# Altium schematic sheet SDNL.SchDoc
size A; SheetNumber: 1; SheetTotal: 1
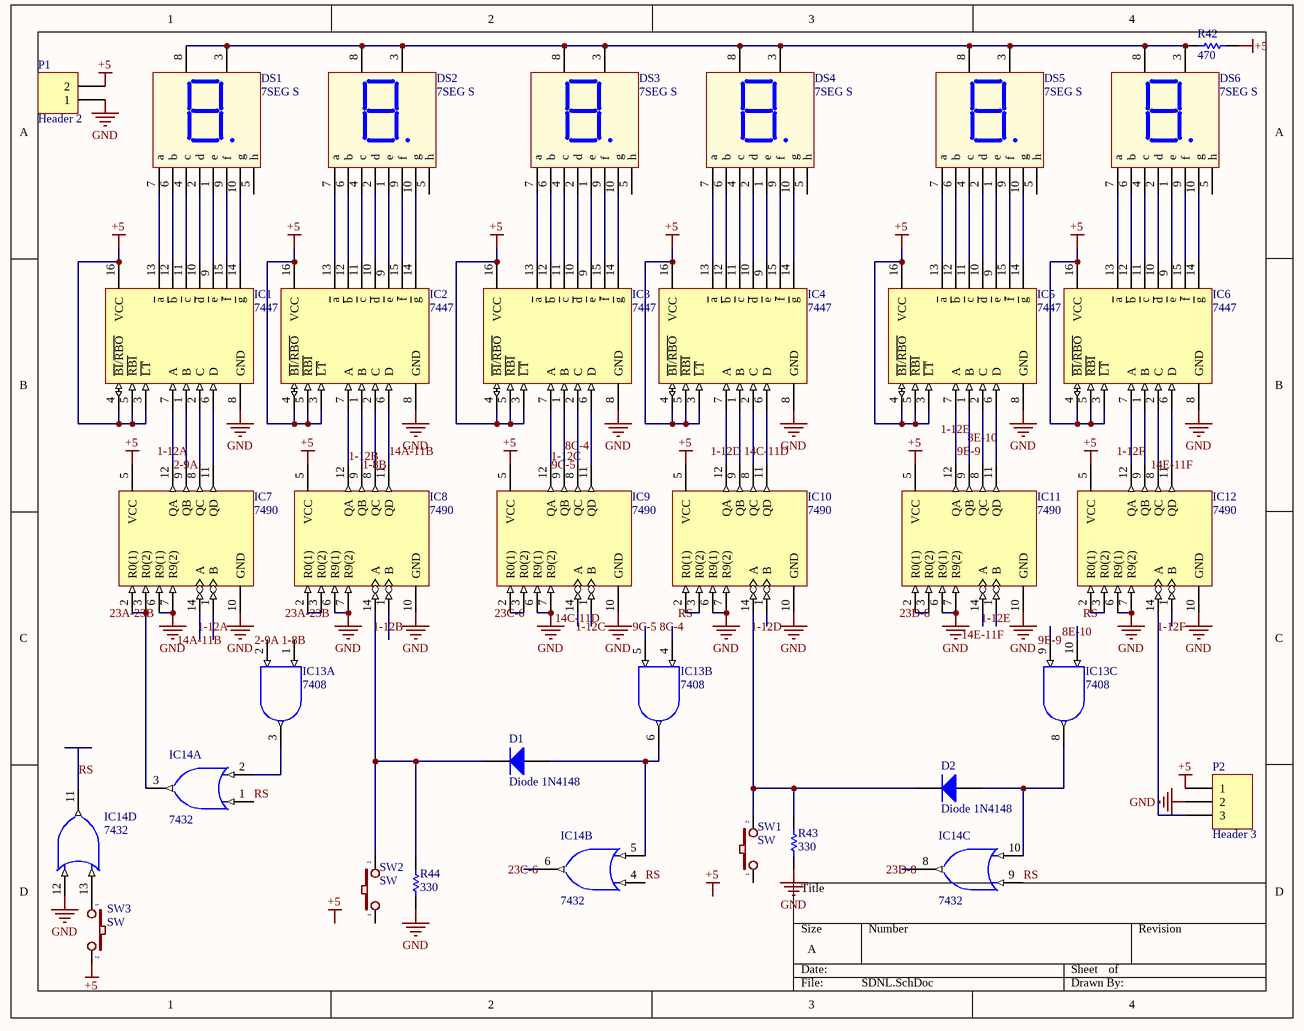
[diagram p0: SDNL.SchDoc]

## Parts
D1  Diode 1N4148  [DO-35]
D2  Diode 1N4148  [DO-35]
DS1  7SEG S  [7SEGS]
DS2  7SEG S  [7SEGS]
DS3  7SEG S  [7SEGS]
DS4  7SEG S  [7SEGS]
DS5  7SEG S  [7SEGS]
DS6  7SEG S  [7SEGS]
IC1  7447  [DIP16/W0.3]
IC2  7447  [DIP16/W0.3]
IC3  7447  [DIP16/W0.3]
IC4  7447  [DIP16/W0.3]
IC5  7447  [DIP16/W0.3]
IC6  7447  [DIP16/W0.3]
IC7  7490  [DIP14/W0.3]
IC8  7490  [DIP14/W0.3]
IC9  7490  [DIP14/W0.3]
IC10  7490  [DIP14/W0.3]
IC11  7490  [DIP14/W0.3]
IC12  7490  [DIP14/W0.3]
IC13  7408  [DIP14/W0.3]  (parts A,B,C of 4)
IC14  7432  [DIP14/W0.3]  (parts A,B,C,D of 4)
P1  Header 2  [TBlock 2]
P2  Header 3  [Header 3]
R42  value 470  [Res 10mm (1/2W)]  (hidden comment: RESISTOR)
R43  value 330  [Res 10mm (1/2W)]  (hidden comment: RESISTOR)
R44  value 330  [Res 10mm (1/2W)]  (hidden comment: RESISTOR)
SW1  SW  [SW2]
SW2  SW  [SW2]
SW3  SW  [SW2]

## Nets
+5: IC1.3(~{LT}) IC1.4(~{BI}/~{RBO}) IC1.5(~{RBI}) IC1.16(VCC) IC2.3(~{LT}) IC2.4(~{BI}/~{RBO}) IC2.5(~{RBI}) IC2.16(VCC) IC3.3(~{LT}) IC3.4(~{BI}/~{RBO}) IC3.5(~{RBI}) IC3.16(VCC) IC4.3(~{LT}) IC4.4(~{BI}/~{RBO}) IC4.5(~{RBI}) IC4.16(VCC) IC5.3(~{LT}) IC5.4(~{BI}/~{RBO}) IC5.5(~{RBI}) IC5.16(VCC) IC6.3(~{LT}) IC6.4(~{BI}/~{RBO}) IC6.5(~{RBI}) IC6.16(VCC) IC7.5(VCC) IC8.5(VCC) IC9.5(VCC) IC10.5(VCC) IC11.5(VCC) IC12.5(VCC) P1.2 P2.1 R42.1 SW3.2
GND: IC1.8(GND) IC2.8(GND) IC3.8(GND) IC4.8(GND) IC5.8(GND) IC6.8(GND) IC7.6(R9(1)) IC7.7(R9(2)) IC7.10(GND) IC8.6(R9(1)) IC8.7(R9(2)) IC8.10(GND) IC9.6(R9(1)) IC9.7(R9(2)) IC9.10(GND) IC10.6(R9(1)) IC10.7(R9(2)) IC10.10(GND) IC11.6(R9(1)) IC11.7(R9(2)) IC11.10(GND) IC12.6(R9(1)) IC12.7(R9(2)) IC12.10(GND) IC13.7(GND) IC14.7(GND) IC14.12(A) P1.1 P2.2 R43.1 R44.1
VCC: IC13.14(VCC) IC14.14(VCC)
1-8B: IC2.2(C) IC8.8(QC) IC13.1(A)
1-12A: IC1.7(A) IC7.1(B) IC7.12(QA)
1-12B: IC2.7(A) IC8.1(B) IC8.12(QA)
1-12C: IC3.7(A) IC9.1(B) IC9.12(QA)
1-12D: IC4.7(A) IC10.1(B) IC10.12(QA)
1-12E: IC5.7(A) IC11.1(B) IC11.12(QA)
1-12F: IC6.7(A) IC12.1(B) IC12.12(QA)
2-9A: IC1.1(B) IC7.9(QB) IC13.2(B)
8C-4: IC3.2(C) IC9.8(QC) IC13.4(A)
8E-10: IC5.2(C) IC11.8(QC) IC13.10(A)
9C-5: IC3.1(B) IC9.9(QB) IC13.5(B)
9E-9: IC5.1(B) IC11.9(QB) IC13.9(B)
14A-11B: IC2.6(D) IC7.14(A) IC8.11(QD)
14C-11D: IC4.6(D) IC9.14(A) IC10.11(QD)
14E-11F: IC6.6(D) IC11.14(A) IC12.11(QD)
23A-23B: IC7.2(R0(1)) IC7.3(R0(2)) IC8.2(R0(1)) IC8.3(R0(2)) IC14.3(Y)
23C-6: IC9.2(R0(1)) IC9.3(R0(2)) IC14.6(Y)
23D-8: IC11.2(R0(1)) IC11.3(R0(2)) IC14.8(Y)
RS: IC10.2(R0(1)) IC10.3(R0(2)) IC12.2(R0(1)) IC12.3(R0(2)) IC14.1(A) IC14.4(A) IC14.9(A) IC14.11(Y)
NetD1_1: D1.1(A) IC13.6(O) IC14.5(B)
NetD1_2: D1.2(K) IC8.14(A) R44.2 SW2.2
NetD2_1: D2.1(A) IC13.8(O) IC14.10(B)
NetD2_2: D2.2(K) IC10.14(A) R43.2 SW1.2
NetDS1_1: DS1.1(e) IC1.9(~{e})
NetDS1_2: DS1.2(d) IC1.10(~{d})
NetDS1_3: DS1.3(Vcc) DS1.8(Vcc) DS2.3(Vcc) DS2.8(Vcc) DS3.3(Vcc) DS3.8(Vcc) DS4.3(Vcc) DS4.8(Vcc) DS5.3(Vcc) DS5.8(Vcc) DS6.3(Vcc) DS6.8(Vcc) R42.2
NetDS1_4: DS1.4(c) IC1.11(~{c})
NetDS1_6: DS1.6(b) IC1.12(~{b})
NetDS1_7: DS1.7(a) IC1.13(~{a})
NetDS1_9: DS1.9(f) IC1.15(~{f})
NetDS1_10: DS1.10(g) IC1.14(~{g})
NetDS2_1: DS2.1(e) IC2.9(~{e})
NetDS2_2: DS2.2(d) IC2.10(~{d})
NetDS2_4: DS2.4(c) IC2.11(~{c})
NetDS2_6: DS2.6(b) IC2.12(~{b})
NetDS2_7: DS2.7(a) IC2.13(~{a})
NetDS2_9: DS2.9(f) IC2.15(~{f})
NetDS2_10: DS2.10(g) IC2.14(~{g})
NetDS3_1: DS3.1(e) IC3.9(~{e})
NetDS3_2: DS3.2(d) IC3.10(~{d})
NetDS3_4: DS3.4(c) IC3.11(~{c})
NetDS3_6: DS3.6(b) IC3.12(~{b})
NetDS3_7: DS3.7(a) IC3.13(~{a})
NetDS3_9: DS3.9(f) IC3.15(~{f})
NetDS3_10: DS3.10(g) IC3.14(~{g})
NetDS4_1: DS4.1(e) IC4.9(~{e})
NetDS4_2: DS4.2(d) IC4.10(~{d})
NetDS4_4: DS4.4(c) IC4.11(~{c})
NetDS4_6: DS4.6(b) IC4.12(~{b})
NetDS4_7: DS4.7(a) IC4.13(~{a})
NetDS4_9: DS4.9(f) IC4.15(~{f})
NetDS4_10: DS4.10(g) IC4.14(~{g})
NetDS5_1: DS5.1(e) IC5.9(~{e})
NetDS5_2: DS5.2(d) IC5.10(~{d})
NetDS5_4: DS5.4(c) IC5.11(~{c})
NetDS5_6: DS5.6(b) IC5.12(~{b})
NetDS5_7: DS5.7(a) IC5.13(~{a})
NetDS5_9: DS5.9(f) IC5.15(~{f})
NetDS5_10: DS5.10(g) IC5.14(~{g})
NetDS6_1: DS6.1(e) IC6.9(~{e})
NetDS6_2: DS6.2(d) IC6.10(~{d})
NetDS6_4: DS6.4(c) IC6.11(~{c})
NetDS6_6: DS6.6(b) IC6.12(~{b})
NetDS6_7: DS6.7(a) IC6.13(~{a})
NetDS6_9: DS6.9(f) IC6.15(~{f})
NetDS6_10: DS6.10(g) IC6.14(~{g})
NetIC1_2: IC1.2(C) IC7.8(QC)
NetIC1_6: IC1.6(D) IC7.11(QD)
NetIC2_1: IC2.1(B) IC8.9(QB)
NetIC3_6: IC3.6(D) IC9.11(QD)
NetIC4_1: IC4.1(B) IC10.9(QB)
NetIC4_2: IC4.2(C) IC10.8(QC)
NetIC5_6: IC5.6(D) IC11.11(QD)
NetIC6_1: IC6.1(B) IC12.9(QB)
NetIC6_2: IC6.2(C) IC12.8(QC)
NetIC12_14: IC12.14(A) P2.3
NetIC13_3: IC13.3(O) IC14.2(B)
NetIC14_13: IC14.13(B) SW3.1

Not connected (* = marked no-connect by the designer): DS1 5(h); DS2 5(h); DS3 5(h); DS4 5(h); DS5 5(h); DS6 5(h); SW1 1; SW2 1

## Notes on the sheet
- Labels drawn without touching a wire or pin: +5

## Library data of the parts
D1 D2 = Diode 1N4148: High Conductance Fast Diode; Published: 8-Jun-2000; LatestRevisionDate: 17-Jul-2002; LatestRevisionNote: Re-released for DXP Platform.; DatasheetVersion: 1997; PackageReference: DO-35; Publisher: Altium Limited; PackageDescription: Diode, Axial; Body 3.8 x 1.9 mm (LxDia. max), Lead Dia. 0.53 mm (max); Code_JEDEC: DO-204-AH; ComponentLink1Description: Manufacturer Link; ComponentLink1URL: http://www.fairchildsemi.com/; ComponentLink2Description: Datasheet; ComponentLink2URL: http://www.fairchildsemi.com/ds/1N%2F1N4148.pdf
DS1-DS6 = LED7S: Single 7 Seg Dipslay; Value: LED 7S SEG
IC1-IC6 = 7447: BCD to 7-Segment Decoder/Driver; Value: 7447 , 74247
IC7-IC12 = 7490: 4-Bit Decade Counter; Value: 7490
IC13 = 7408: Quad 2-Input AND Gate; Value: 7408
IC14 = 7432: Quad 2-Input OR Gate
P1 = Header 2: Header, 2-Pin; LatestRevisionDate: 17-Jul-2002; LatestRevisionNote: Re-released for DXP Platform.; Publisher: Altium Limited
P2 = Header 3: Header, 3-Pin; LatestRevisionDate: 17-Jul-2002; LatestRevisionNote: Re-released for DXP Platform.; Publisher: Altium Limited
SW1-SW3 = SW2: Switch button 2 pin; Value: SW chip 2 pin
R42-R44 = RESISTOR: Published: 8-Jun-2000; LatestRevisionDate: 17-Jul-2002; LatestRevisionNote: Re-released for DXP Platform.; PackageReference: AXIAL-0.3; Publisher: Altium Limited